# EasyEDA schematic SCH_TEST_2022-02-16.json
TITLE: Sheet_1; REV: 1.0; Date: 2022-02-14; Sheet: 1/1; Drawn By: tanimun_hasan; Company: Your Company
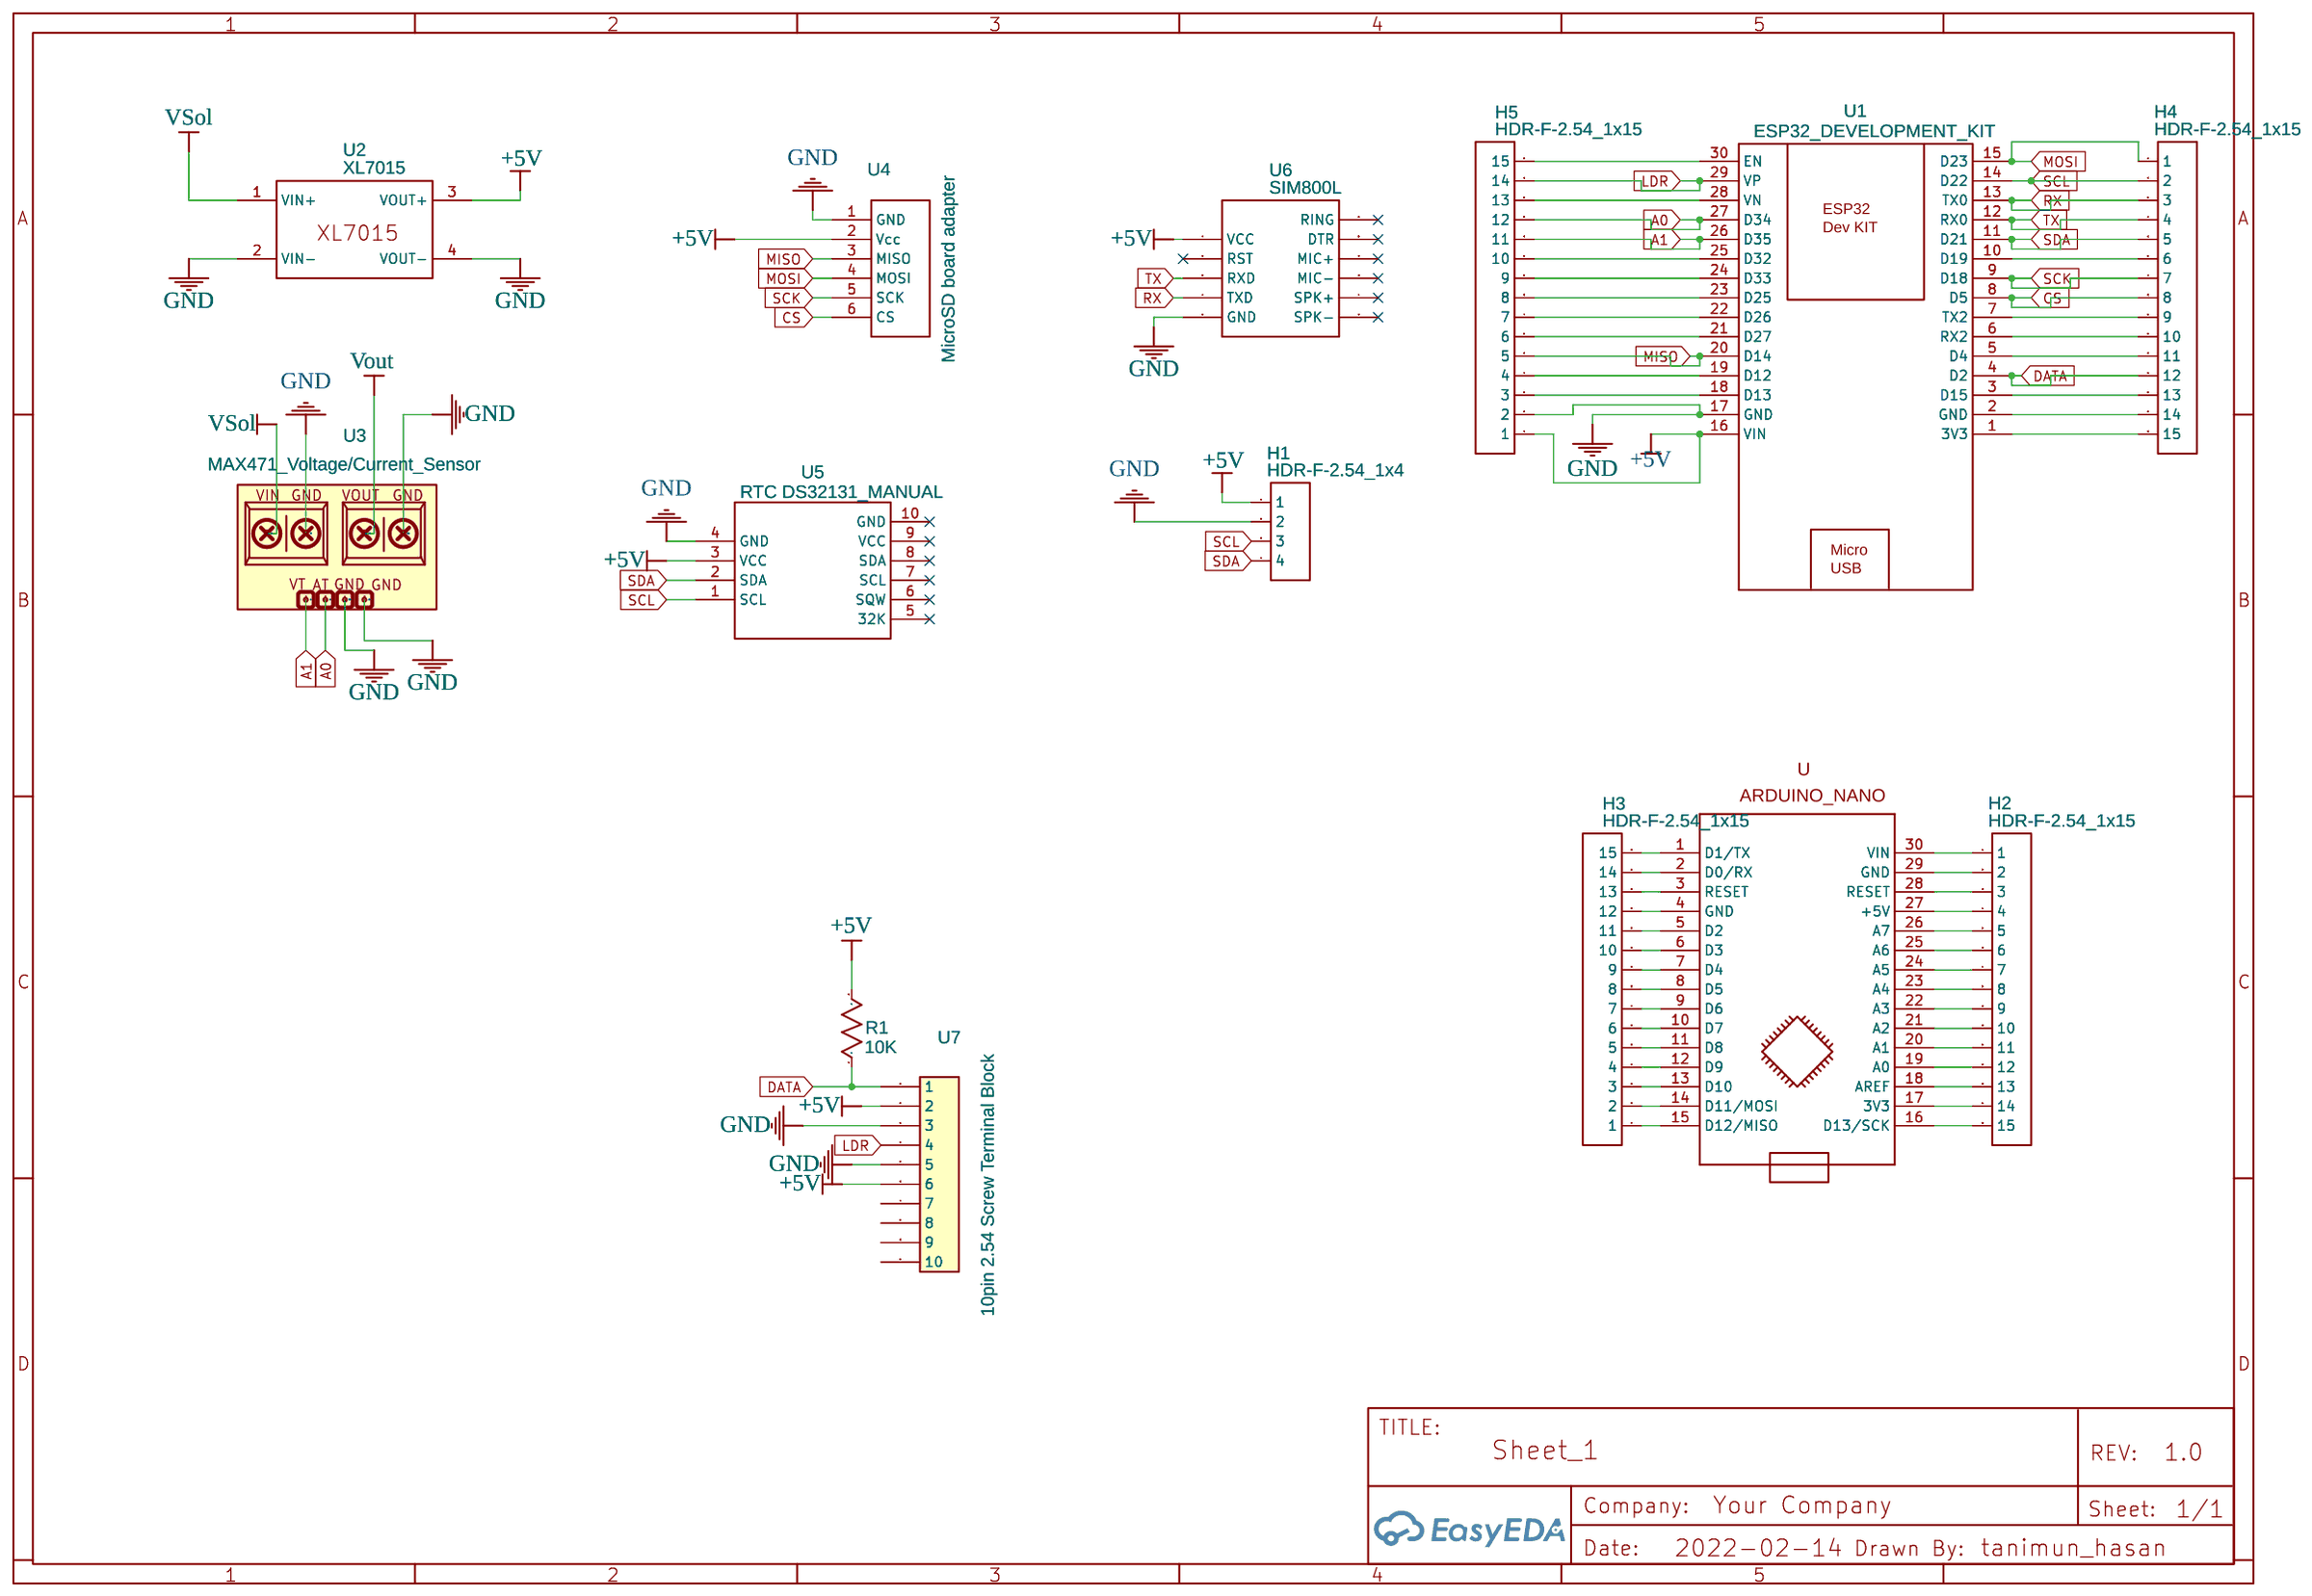
[diagram p0: schematic sheet]

## Parts
H1  HDR-F-2.54_1x4  [HDR-F-2.54_1X4]
H2  HDR-F-2.54_1x15  [HDR-F-2.54_1X15]
H3  HDR-F-2.54_1x15  [HDR-F-2.54_1X15]
H4  HDR-F-2.54_1x15  [HDR-F-2.54_1X15]
H5  HDR-F-2.54_1x15  [HDR-F-2.54_1X15]
R1  10K  [R_AXIAL-0.4]
U1  ESP32_DEVELOPMENT_KIT  [ESP32_DEVELOPMENT_KIT]
U2  XL7015  [XL7015]
U3  MAX471_Voltage/Current_Sensor  [MAX471_VOLTAGE/CURRENT_SENSOR]
U4  MicroSD board adapter  [MICROSD CARD ADAPTER]
U5  RTC DS32131_MANUAL  [RTC DS32131_MANUAL]
U6  SIM800L  [SIM800L]
U7  10pin 2.54 Screw Terminal Block  [10PIN2.54SCREWTERMINALBLOCK]
U8  Arduino-NANO  [ARDUINO-NANO]

## Library data of the parts
H1 = HDR-F-2.54_1x4: Supplier Part: C225501; Supplier: LCSC; Contributor: LCEDA_Lib
H2-H5 = HDR-F-2.54_1x15: Supplier Part: C124408; Supplier: LCSC; Contributor: LCEDA_Lib
R1 = R_AXIAL-0.4_US: Contributor: LCEDA_Lib
U1 = ESP32_DEVELOPMENT_KIT: Manufacturer Part: ESP32 Development KIT; Contributor: Alain Falcoz
U2 = XL7015: Contributor: hafiz_8030
U3 = MAX471_Voltage/Current_Sensor: Contributor: breezebro
U4 = MicroSD board adapter: Supplier: Hernan; Contributor: hernanmario31
U5 = RTC DS32131_MANUAL: Contributor: shaikh.g
U6 = SIM800L: Contributor: colibrilab
U7 = 10pin 2.54 Screw Terminal Block: Contributor: andrewivkh
U8 = Arduino-NANO: Supplier Part: undefined; Supplier: TME; Contributor: Dancris

## Nets
+5V: H1.1 H5.1 R1.2 U1.16(VIN) U2.3(VOUT+) U4.2(Vcc) U5.3(VCC) U6.1(VCC) U7.2 U7.6
GND: H1.2 H5.2 U1.17(GND) U2.2(VIN-) U2.4(VOUT-) U3.2(GND) U3.4(GND) U3.7(GND) U3.8(GND) U4.1(GND) U5.4(GND) U6.5(GND) U7.3 U7.5
A0: H5.12 U1.27(D34) U3.6(AT)
A1: H5.11 U1.26(D35) U3.5(VT)
CS: H4.8 U1.8(D5) U4.6(CS)
DATA: H4.12 R1.1 U1.4(D2) U7.1
LDR: H5.14 U1.29(VP) U7.4
MISO: H5.5 U1.20(D14) U4.3(MISO)
MOSI: H4.1 U1.15(D23) U4.4(MOSI)
RX: H4.3 U1.13(TX0) U6.4(TXD)
SCK: H4.7 U1.9(D18) U4.5(SCK)
SCL: H1.3 H4.2 U1.14(D22) U5.1(SCL)
SDA: H1.4 H4.5 U1.11(D21) U5.2(SDA)
TX: H4.4 U1.12(RX0) U6.3(RXD)
Vout: U3.3(VOUT)
VSol: U2.1(VIN+) U3.1(VIN)
Net-(H2-1): H2.1 U8.30(VIN)
Net-(H2-2): H2.2 U8.29(GND)
Net-(H2-3): H2.3 U8.28(RESET)
Net-(H2-4): H2.4 U8.27(+5V)
Net-(H2-5): H2.5 U8.26(A7)
Net-(H2-6): H2.6 U8.25(A6)
Net-(H2-7): H2.7 U8.24(A5)
Net-(H2-8): H2.8 U8.23(A4)
Net-(H2-9): H2.9 U8.22(A3)
Net-(H2-10): H2.10 U8.21(A2)
Net-(H2-11): H2.11 U8.20(A1)
Net-(H2-12): H2.12 U8.19(A0)
Net-(H2-13): H2.13 U8.18(AREF)
Net-(H2-14): H2.14 U8.17(3V3)
Net-(H2-15): H2.15 U8.16(D13/SCK)
Net-(H3-1): H3.1 U8.15(D12/MISO)
Net-(H3-2): H3.2 U8.14(D11/MOSI)
Net-(H3-3): H3.3 U8.13(D10)
Net-(H3-4): H3.4 U8.12(D9)
Net-(H3-5): H3.5 U8.11(D8)
Net-(H3-6): H3.6 U8.10(D7)
Net-(H3-7): H3.7 U8.9(D6)
Net-(H3-8): H3.8 U8.8(D5)
Net-(H3-9): H3.9 U8.7(D4)
Net-(H3-10): H3.10 U8.6(D3)
Net-(H3-11): H3.11 U8.5(D2)
Net-(H3-12): H3.12 U8.4(GND)
Net-(H3-13): H3.13 U8.3(RESET)
Net-(H3-14): H3.14 U8.2(D0/RX)
Net-(H3-15): H3.15 U8.1(D1/TX)
Net-(H4-6): H4.6 U1.10(D19)
Net-(H4-9): H4.9 U1.7(TX2)
Net-(H4-10): H4.10 U1.6(RX2)
Net-(H4-11): H4.11 U1.5(D4)
Net-(H4-13): H4.13 U1.3(D15)
Net-(H4-14): H4.14 U1.2(GND)
Net-(H4-15): H4.15 U1.1(3V3)
Net-(H5-3): H5.3 U1.18(D13)
Net-(H5-4): H5.4 U1.19(D12)
Net-(H5-6): H5.6 U1.21(D27)
Net-(H5-7): H5.7 U1.22(D26)
Net-(H5-8): H5.8 U1.23(D25)
Net-(H5-9): H5.9 U1.24(D33)
Net-(H5-10): H5.10 U1.25(D32)
Net-(H5-13): H5.13 U1.28(VN)
Net-(H5-15): H5.15 U1.30(EN)

Not connected (* = marked no-connect by the designer): U5 5(32K)* 6(SQW)* 7(SCL)* 8(SDA)* 9(VCC)* 10(GND)*; U6 2(RST)* 6(SPK-)* 7(SPK+)* 8(MIC-)* 9(MIC+)* 10(DTR)* 11(RING)*; U7 7 8 9 10
